# EAGLE schematic lighting (EAGLE 8.5.0)
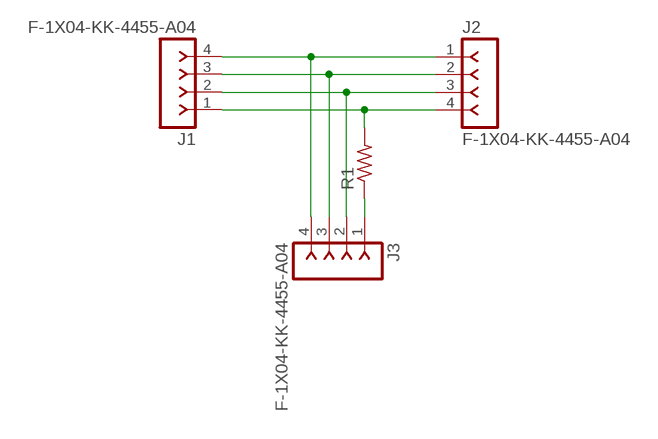
[diagram p0: schematic, sheet 1]

## Parts
J1  F-1X04-KK-4455-A04  [KK-4455-A04]
J2  F-1X04-KK-4455-A04  [KK-4455-A04]
J3  F-1X04-KK-4455-A04  [KK-4455-A04]
R1  R-US_0207/12  [0207/12]

## Nets
N$1: J1.4 J2.1 J3.4
N$2: J1.3 J2.2 J3.3
N$3: J1.2 J2.3 J3.2
N$4: J1.1 J2.4 R1.2
N$5: J3.1 R1.1

## Library data of the parts
J1-J3 = con-headers-jp:F-1X04-: FEMALE HEADER
R1 = resistor:R-US_: RESISTOR, American symbol